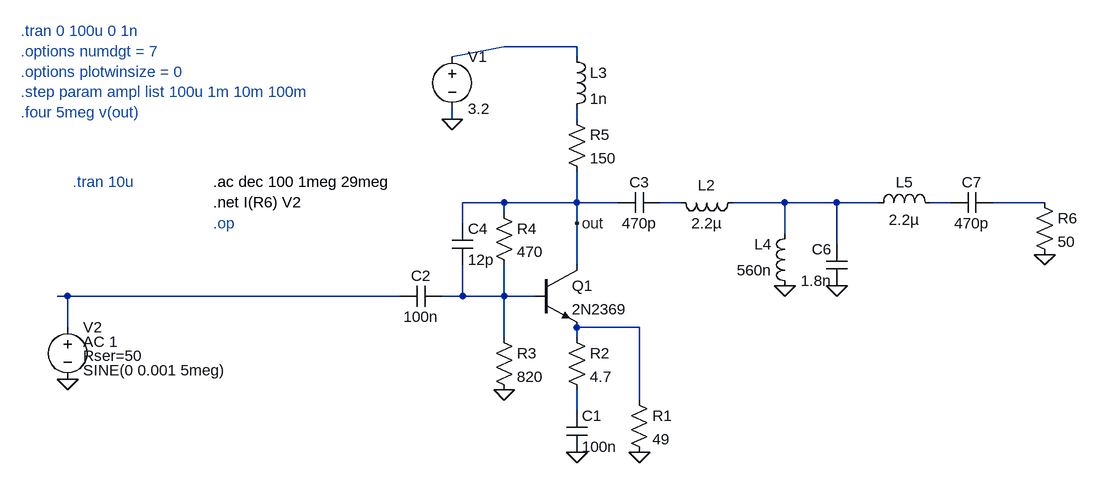
[diagram p0: schematic amplifier.asc]
amplifier.asc, the LTspice schematic file:
Version 4
SHEET 1 1220 736
WIRE 448 48 336 48
WIRE 256 64 336 48
WIRE 448 64 448 48
WIRE 256 160 256 144
WIRE 448 160 448 144
WIRE 336 288 272 288
WIRE 448 288 448 240
WIRE 448 288 336 288
WIRE 512 288 448 288
WIRE 608 288 576 288
WIRE 768 288 688 288
WIRE 848 288 768 288
WIRE 912 288 848 288
WIRE 1024 288 992 288
WIRE 1168 288 1088 288
WIRE 336 304 336 288
WIRE 272 320 272 288
WIRE 448 320 448 288
WIRE 768 336 768 288
WIRE 848 352 848 288
WIRE 448 384 448 320
WIRE -336 432 -352 432
WIRE 176 432 -336 432
WIRE 272 432 272 384
WIRE 272 432 240 432
WIRE 336 432 336 384
WIRE 336 432 272 432
WIRE 384 432 336 432
WIRE -336 480 -336 432
WIRE 544 480 448 480
WIRE 336 496 336 432
WIRE 448 496 448 480
WIRE 544 592 544 480
WIRE 448 608 448 576
FLAG 544 672 0
FLAG 448 672 0
FLAG 336 576 0
FLAG 1168 368 0
FLAG 256 160 0
FLAG -336 560 0
FLAG 448 320 out
FLAG 848 416 0
FLAG 768 416 0
DATAFLAG 368 432 "$"
DATAFLAG 448 288 "$"
DATAFLAG 544 528 "$"
SYMBOL npn 384 384 R0
SYMATTR InstName Q1
SYMATTR Value 2N2369
SYMBOL cap 432 608 R0
SYMATTR InstName C1
SYMATTR Value 100n
SYMBOL res 528 576 R0
SYMATTR InstName R1
SYMATTR Value 49
SYMBOL res 432 480 R0
SYMATTR InstName R2
SYMATTR Value 4.7
SYMBOL res 320 480 R0
SYMATTR InstName R3
SYMATTR Value 820
SYMBOL res 320 288 R0
SYMATTR InstName R4
SYMATTR Value 470
SYMBOL res 432 144 R0
SYMATTR InstName R5
SYMATTR Value 150
SYMBOL cap 240 416 R90
WINDOW 0 0 32 VBottom 2
WINDOW 3 32 32 VTop 2
SYMATTR InstName C2
SYMATTR Value 100n
SYMBOL cap 576 272 R90
WINDOW 0 0 32 VBottom 2
WINDOW 3 32 32 VTop 2
SYMATTR InstName C3
SYMATTR Value 470p
SYMBOL res 1152 272 R0
SYMATTR InstName R6
SYMATTR Value 50
SYMBOL voltage 256 48 R0
SYMATTR InstName V1
SYMATTR Value 3.2
SYMBOL voltage -336 464 R0
WINDOW 3 24 82 Left 2
WINDOW 123 24 38 Left 2
WINDOW 39 24 60 Left 2
SYMATTR Value SINE(0 0.001 5meg)
SYMATTR Value2 AC 1
SYMATTR SpiceLine Rser=50
SYMATTR InstName V2
SYMBOL cap 256 320 R0
SYMATTR InstName C4
SYMATTR Value 12p
SYMBOL ind 432 48 R0
SYMATTR InstName L3
SYMATTR Value 1n
SYMBOL ind 704 272 R90
WINDOW 0 5 56 VBottom 2
WINDOW 3 32 56 VTop 2
SYMATTR InstName L2
SYMATTR Value 2.2µ
SYMBOL ind 784 432 R180
WINDOW 0 36 80 Left 2
WINDOW 3 36 40 Left 2
SYMATTR InstName L4
SYMATTR Value 560n
SYMBOL ind 896 304 R270
WINDOW 0 32 56 VTop 2
WINDOW 3 5 56 VBottom 2
SYMATTR InstName L5
SYMATTR Value 2.2µ
SYMBOL cap 864 416 R180
WINDOW 0 24 56 Left 2
WINDOW 3 24 8 Left 2
SYMATTR InstName C6
SYMATTR Value 1.8n
SYMBOL cap 1024 304 R270
WINDOW 0 32 32 VTop 2
WINDOW 3 0 32 VBottom 2
SYMATTR InstName C7
SYMATTR Value 470p
TEXT -112 256 Left 2 !.ac dec 100 1meg 29meg\n.net I(R6) V2
TEXT -408 24 Left 2 ;.tran 0 100u 0 1n\n.options numdgt = 7\n.options plotwinsize = 0\n.step param ampl list 100u 1m 10m 100m\n.four 5meg v(out)
TEXT -328 256 Left 2 ;.tran 10u
TEXT -112 320 Left 2 ;.op

The netlist it stands for:
* amplifier.asc
Q1 out N008 N009 0 2N2369
C1 N010 0 100n
R1 N009 0 49
R2 N009 N010 4.7
R3 N008 0 820
R4 out N008 470
R5 N002 out 150
C2 N008 N007 100n
C3 N003 out 470p
R6 N006 0 50
V1 N001 0 3.2
V2 N007 0 SINE(0 0.001 5meg) AC 1 Rser=50
C4 out N008 12p
L3 N001 N002 1n
L2 N004 N003 2.2µ
L4 0 N004 560n
L5 N004 N005 2.2µ
C6 0 N004 1.8n
C7 N005 N006 470p
.model NPN NPN
.model PNP PNP
.lib standard.bjt
.ac dec 100 1meg 29meg
.net I(R6) V2
* .tran 0 100u 0 1n
* .options numdgt = 7
* .options plotwinsize = 0
* .step param ampl list 100u 1m 10m 100m
* .four 5meg v(out)
* .tran 10u
* .op
.backanno
.end